# EAGLE design minicopter (EAGLE 7.2.0)
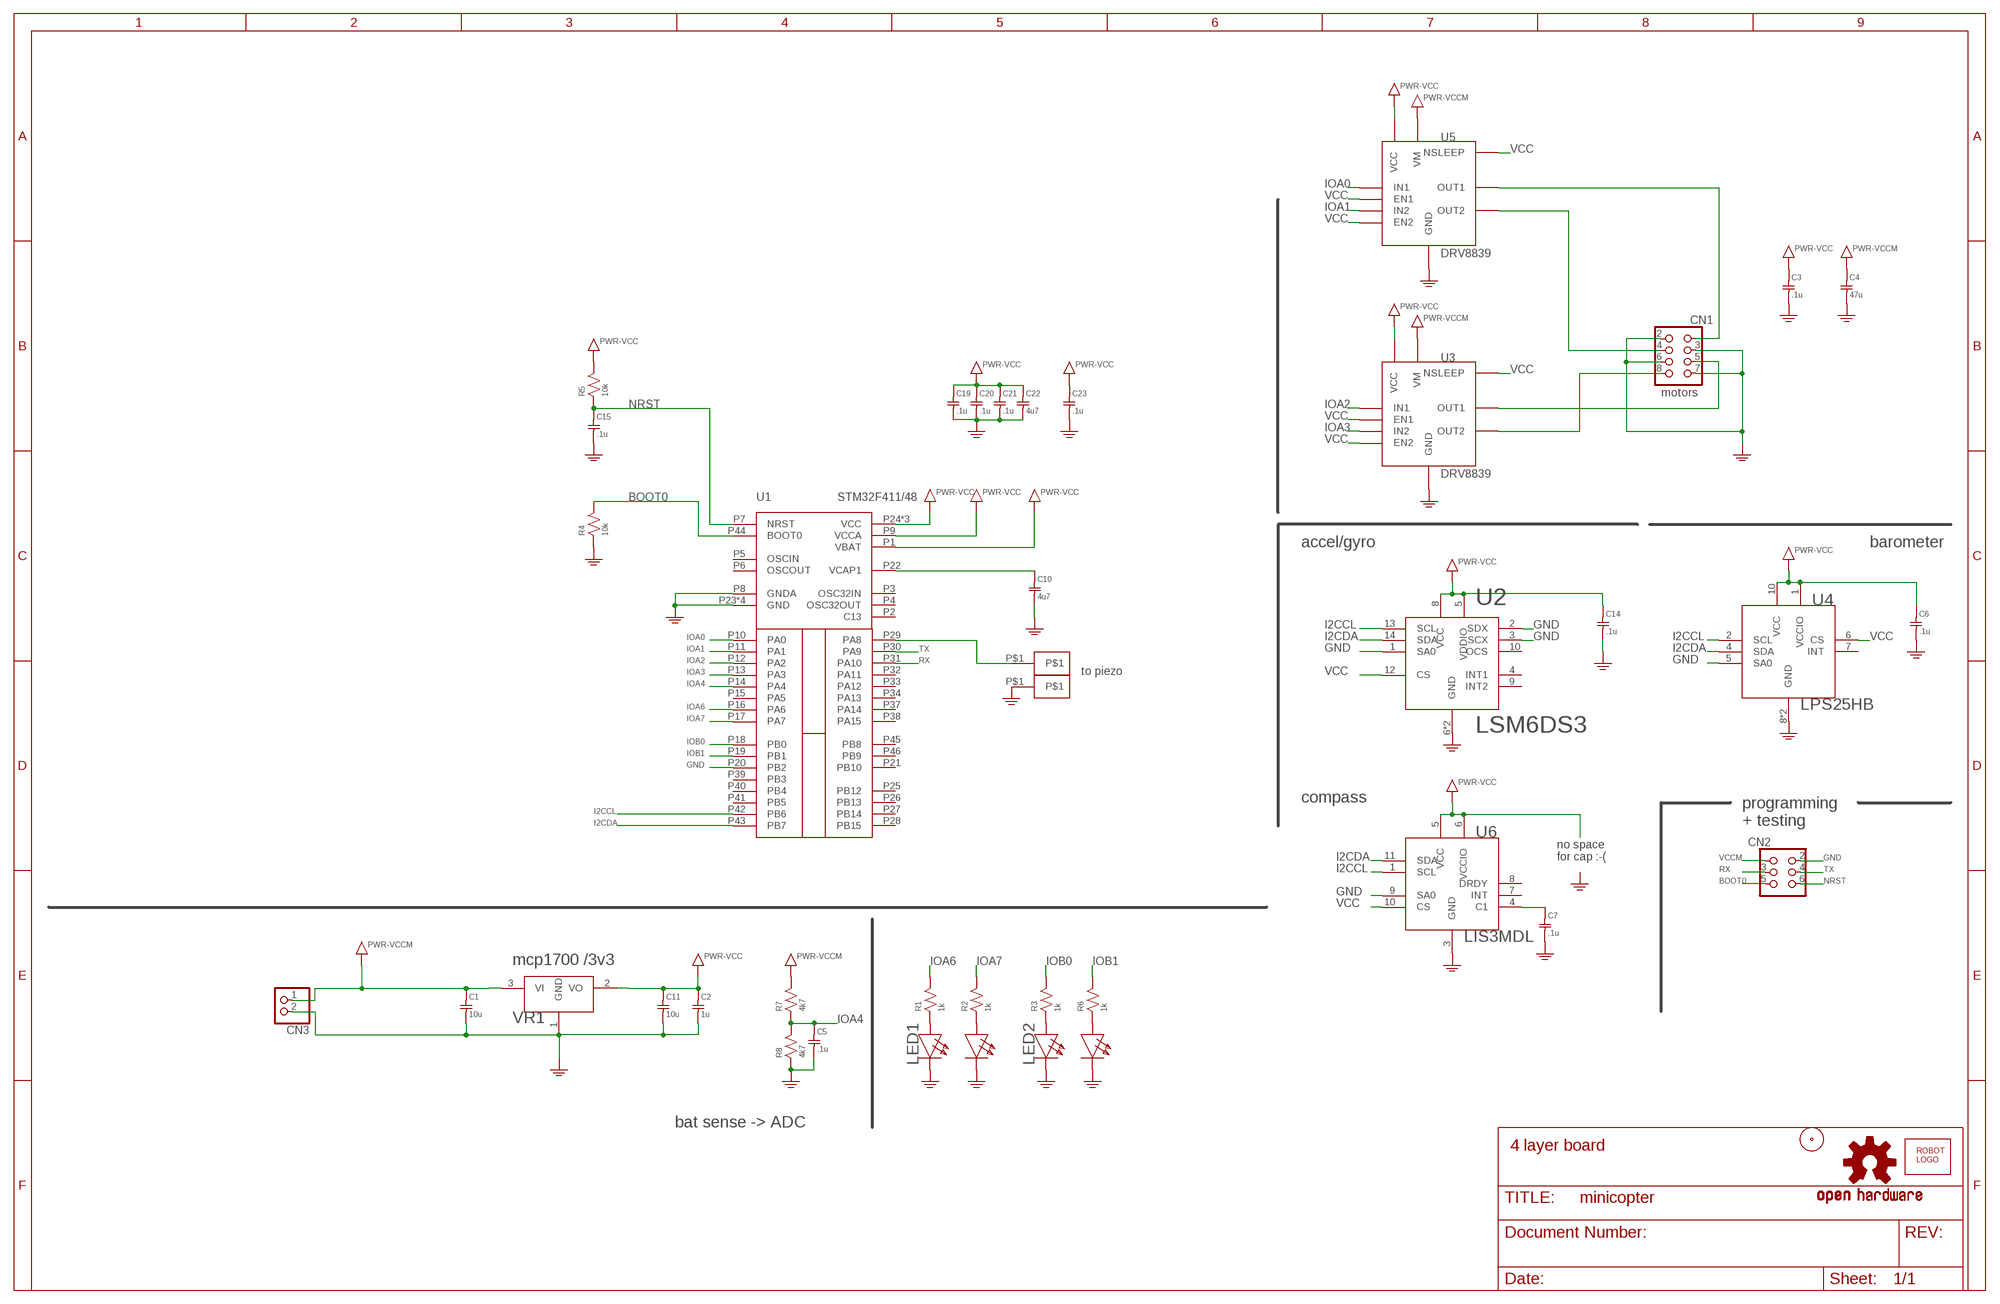
[diagram p0: schematic, sheet 1]

## Parts
C1  10u  C0603  [SMD0603]
C2  1u  C0603  [SMD0603]
C3  .1u  C0603  [SMD0603]
C4  47u  C0805  [SMD0805]
C5  .1u  C0603  [SMD0603]
C6  .1u  C0603  [SMD0603]
C7  .1u  C0603  [SMD0603]
C10  4u7  C0603  [SMD0603]
C11  10u  C0603  [SMD0603]
C14  .1u  C0603  [SMD0603]
C15  .1u  C0603  [SMD0603]
C19  .1u  C0603  [SMD0603]
C20  .1u  C0603  [SMD0603]
C21  .1u  C0603  [SMD0603]
C22  4u7  C0603  [SMD0603]
C23  .1u  C0603  [SMD0603]
CN1  HEADER-2X4  [HEADER-2X04-THM]
CN2  HEADER-3X2-PTH  [HEADER-3X2-PTH]
CN3  JST_2PIN-THM  [JST-PH-2-THM]
CN4  HEADER-1X1SMALL  [HEADER-1X1-SMALL]
CN5  HEADER-1X1SMALL  [HEADER-1X1-SMALL]
LED1  LED-DUAL0805  [SMD0805-DUAL]
LED2  LED-DUAL0805  [SMD0805-DUAL]
LOGO1  OSHW-LOGOM  [OSHW-LOGO-M]
R1  1k  R0603  [SMD0603]
R2  1k  R0603  [SMD0603]
R3  1k  R0603  [SMD0603]
R4  10k  R0603  [SMD0603]
R5  10k  R0603  [SMD0603]
R6  1k  R0603  [SMD0603]
R7  4k7  R0603  [SMD0603]
R8  4k7  R0603  [SMD0603]
U1  STM32F411/48  [UQPFN48]
U2  LSM6DS3  [LGA14A]
U3  DRV8839  [WSON12]
U4  LPS25HB  [HLGA10L]
U5  DRV8839  [WSON12]
U6  LIS3MDL  [LGA12]
U$1  ROBOTMAN-LOGO  [ROBOTMAN-LOGO]
U$2  FIDUCIAL  [FIDUCIAL]
VR1  mcp1700 /3v3  REGULATOR-SOT23-3  [SOT-23-3]

## Nets
BOOT0: CN2.5 R4.2 U1.P44(BOOT0)
GND: C1.2 C2.2 C3.2 C4.2 C5.2 C6.2 C7.2 C10.2 C11.2 C14.2 C15.2 C19.2 C20.2 C21.2 C22.2 C23.2 CN1.2 CN1.3 CN1.6 CN1.7 CN2.2 CN3.2 CN5.P$1 LED1.2(CB) LED1.3(CR) LED2.2(CB) LED2.3(CR) R4.1 R8.1 U1.P8(GNDA) U1.P20(PB2) U1.P23(GND) U1.P35(GND) U1.P47(GND) U1.PAD(GND) U2.1(SA0) U2.2(SDX) U2.3(SCX) U2.6(GND) U2.7(GND) U3.5(GND) U3.6(GND) U3.GND3(GND) U3.GND4(GND) U3.GND5(GND) U3.GND6(GND) U3.GND7(GND) U4.5(SA0) U4.8(GND) U4.9(GND) U5.5(GND) U5.6(GND) U5.GND3(GND) U5.GND4(GND) U5.GND5(GND) U5.GND6(GND) U5.GND7(GND) U6.3(GND) U6.9(SA0) VR1.1(GND) ; supply symbol labelled PWR-GND
I2CCL: U1.P42(PB6) U2.13(SCL) U4.2(SCL) U6.1(SCL)
I2CDA: U1.P43(PB7) U2.14(SDA) U4.4(SDA) U6.11(SDA)
IOA0: U1.P10(PA0) U5.10(IN1)
IOA1: U1.P11(PA1) U5.8(IN2)
IOA2: U1.P12(PA2) U3.10(IN1)
IOA3: U1.P13(PA3) U3.8(IN2)
IOA4: C5.1 R7.1 R8.2 U1.P14(PA4)
IOA6: R1.2 U1.P16(PA6)
IOA7: R2.2 U1.P17(PA7)
IOB0: R3.2 U1.P18(PB0)
IOB1: R6.2 U1.P19(PB1)
N$12: LED1.1(AB) R1.1
N$13: LED1.4(AR) R2.1
N$14: LED2.1(AB) R3.1
N$15: LED2.4(AR) R6.1
N$16: CN1.1 U5.3(OUT1)
N$17: CN1.4 U5.4(OUT2)
N$18: C10.1 U1.P22(VCAP1)
N$19: CN1.5 U3.3(OUT1)
N$20: CN1.8 U3.4(OUT2)
N$23: C7.1 U6.4(C1)
NRST: C15.1 CN2.6 R5.1 U1.P7(NRST)
PZ0: CN4.P$1 U1.P29(PA8)
RX: CN2.3 U1.P31(PA10)
TX: CN2.4 U1.P30(PA9)
VCC: C2.1 C3.1 C6.1 C11.1 C14.1 C19.1 C20.1 C21.1 C22.1 C23.1 R5.2 U1.P1(VBAT) U1.P9(VCCA) U1.P24(VCC) U1.P36(VCC) U1.P48(VCC) U2.5(VDDIO) U2.8(VCC) U2.12(CS) U3.7(EN2) U3.9(EN1) U3.11(NSLEEP) U3.12(VCC) U4.1(VCCIO) U4.6(CS) U4.10(VCC) U5.7(EN2) U5.9(EN1) U5.11(NSLEEP) U5.12(VCC) U6.5(VCC) U6.6(VCCIO) U6.10(CS) VR1.2(VO) ; supply symbol labelled PWR-VCC
VCCM: C1.1 C4.1 CN2.1 CN3.1 R7.2 U3.1(VM) U3.2(VM) U5.1(VM) U5.2(VM) VR1.3(VI) ; supply symbol labelled PWR-VCCM
Unconnected: U1.P2(C13) U1.P3(OSC32IN) U1.P4(OSC32OUT) U1.P5(OSCIN) U1.P6(OSCOUT) U1.P15(PA5) U1.P21(PB10) U1.P25(PB12) U1.P26(PB13) U1.P27(PB14) U1.P28(PB15) U1.P32(PA11) U1.P33(PA12) U1.P34(PA13) U1.P37(PA14) U1.P38(PA15) U1.P39(PB3) U1.P40(PB4) U1.P41(PB5) U1.P45(PB8) U1.P46(PB9) U2.4(INT1) U2.9(INT2) U2.10(OCS) U4.7(INT) U6.7(INT) U6.8(DRDY)

## Notes on the sheet
- motors
- accel/gyro | barometer
- to piezo
- compass
- programming
  + testing
- no space
  for cap :-(
- bat sense -> ADC
- 4 layer board

## Library data of the parts
C1-C7 C10 C11 C14 C15 C19-C23 = jaw:C
CN1 = jaw:HEADER-2X4: PIN HEADER
CN2 = jaw:HEADER-3X2
CN3 = adafruit:JST_2PIN: JST 2-Pin Connectors of various flavors SMT-RA (S2B-PH-SM4) 4UConnector #17311 SMT (B2B-PH-SM4) THM-RA (S2B-PH) THM (B2B-PH)
CN4 CN5 = jaw:HEADER-1X1
LED1 LED2 = jaw:LED-DUAL
LOGO1 = SparkFun-Aesthetics:OSHW-LOGO: Open Source Hardware Logo This logo indicates the piece of hardware it is found on incorporates a OSHW license and/or adheres to the definition of open source hardware found here: http://freedomdefined.org/OSHW
R1-R8 = jaw:R
U1 = jaw:STM32F411/48
U2 = jaw:LSM6DS3
U3 U5 = jaw:DRV8839
U4 = jaw:LPS25HB
U6 = jaw:LIS3MDL
U$1 = jaw:ROBOTMAN-LOGO
U$2 = jaw:FIDUCIAL
VR1 = jaw:REGULATOR

## Board
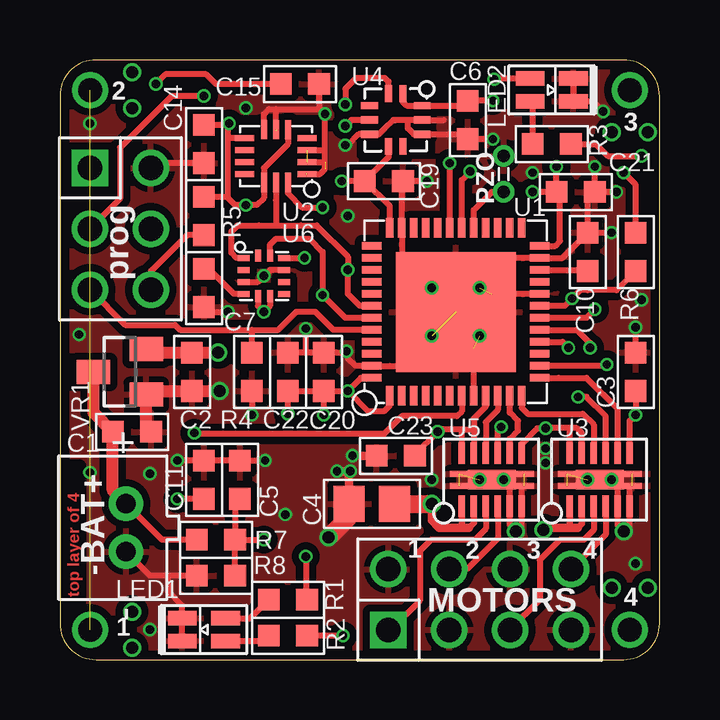
[diagram p1: board, top side]
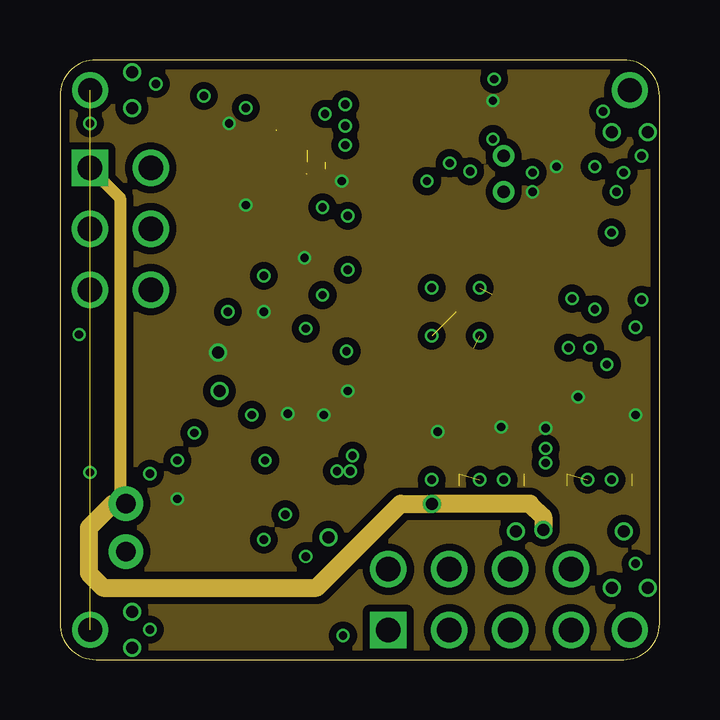
[diagram p2: board, inner layer Route2]
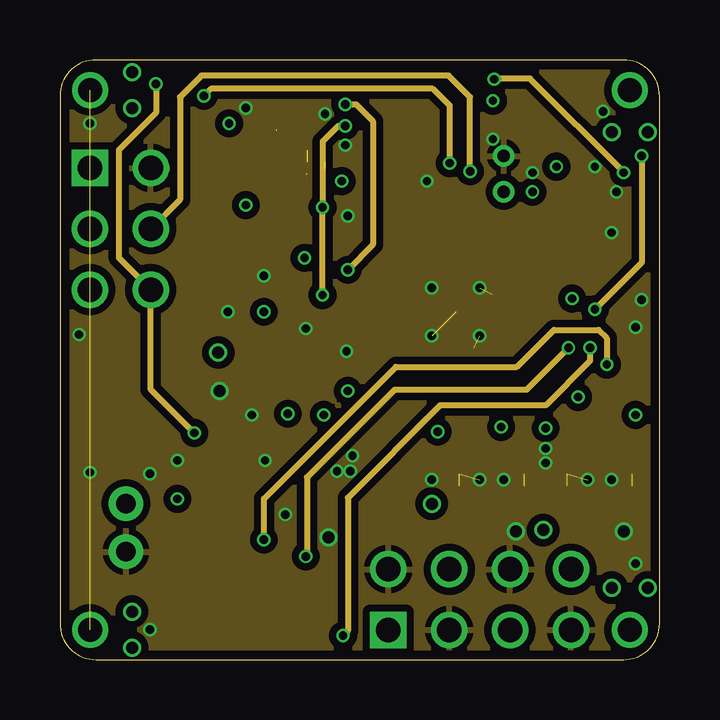
[diagram p3: board, inner layer Route15]
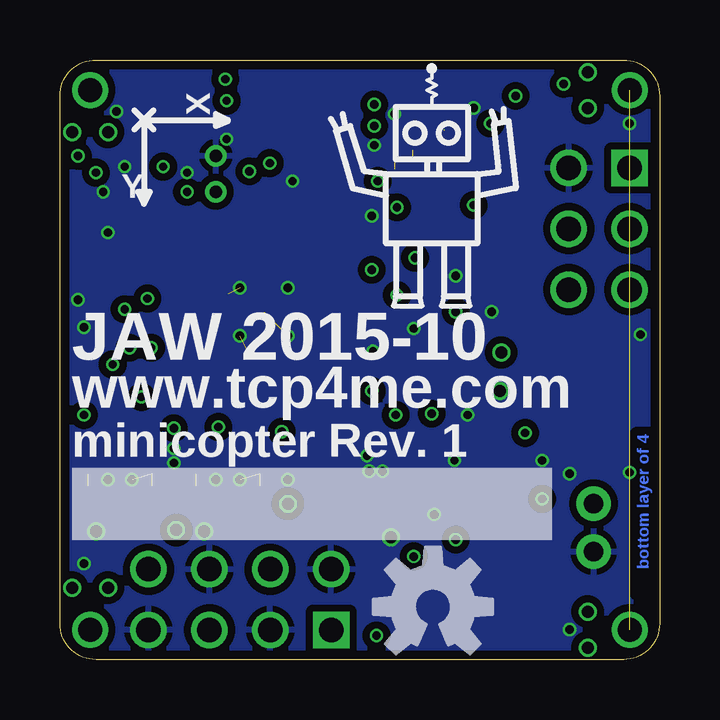
[diagram p4: board, bottom side, seen from below]

Size 25 x 25 mm. Coordinates in mm from the lower left corner, seen from the top.
Outline: 25,1.5 25,23.5 arc90 23.5,25 1.5,25 arc90 0,23.5 0,1.5 arc90 1.5,0 23.5,0 arc90 25,1.5
Copper layers (1*2*15*16): Top 0.035559375mm / dielectric 0.17018125mm / Route2 0.01778125mm / dielectric 47mil / Route15 0.01778125mm / dielectric 0.17018125mm / Bottom 0.035559375mm
Design rules "OSHPark-4layer *": minimum track width 5mil, minimum drill 10mil, track to track 5mil, track to pad 5mil, pad to pad 5mil, via to via 5mil, smd to smd 5mil, copper to edge 15mil, drill to drill 6mil, minimum pad ring 4mil, minimum via ring 4mil, stop-mask expansion 4mil, vias tented up to drill 0.5mm, thermal gap 10mil

### Footprints (pad centres in the part's own frame; a part is rotated, then mirrored left to right if it is on the bottom)
SMD0603 = smd 0.9 x 0.9: 1 -0.8,0; 2 0.8,0
SMD0805 = smd 1.3 x 1.5: 1 -0.95,0; 2 0.95,0
HEADER-2X04-THM = drill 1.016 square: 1 -3.81,-1.27 | drill 1.016: 2 -3.81,1.27; 3 -1.27,-1.27; 4 -1.27,1.27; 5 1.27,-1.27; 6 1.27,1.27; 7 3.81,-1.27; 8 3.81,1.27
HEADER-3X2-PTH = drill 1.016 square: 1 0,0 | drill 1.016: 2 0,2.54; 3 2.54,0; 4 2.54,2.54; 5 5.08,0; 6 5.08,2.54
JST-PH-2-THM = drill 0.8 pad 1.422: 1 1,0; 2 -1,0
HEADER-1X1-SMALL = drill 0.508 pad 0.889: P$1 0,0
SMD0805-DUAL = smd 1.2 x 0.6: 1 -0.9,-0.475; 2 0.9,-0.475; 3 0.9,0.475; 4 -0.9,0.475
UQPFN48 = smd 0.3 x 0.8: P1 -2.75,-3.5; P2 -2.25,-3.5; P3 -1.75,-3.5; P4 -1.25,-3.5; P5 -0.75,-3.5; P6 -0.25,-3.5; P7 0.25,-3.5; P8 0.75,-3.5; P9 1.25,-3.5; P10 1.75,-3.5; P11 2.25,-3.5; P12 2.75,-3.5; P25 2.75,3.5; P26 2.25,3.5; P27 1.75,3.5; P28 1.25,3.5; P29 0.75,3.5; P30 0.25,3.5; P31 -0.25,3.5; P32 -0.75,3.5; P33 -1.25,3.5; P34 -1.75,3.5; P35 -2.25,3.5; P36 -2.75,3.5 | smd 0.8 x 0.3: P13 3.5,-2.75; P14 3.5,-2.25; P15 3.5,-1.75; P16 3.5,-1.25; P17 3.5,-0.75; P18 3.5,-0.25; P19 3.5,0.25; P20 3.5,0.75; P21 3.5,1.25; P22 3.5,1.75; P23 3.5,2.25; P24 3.5,2.75; P37 -3.5,2.75; P38 -3.5,2.25; P39 -3.5,1.75; P40 -3.5,1.25; P41 -3.5,0.75; P42 -3.5,0.25; P43 -3.5,-0.25; P44 -3.5,-0.75; P45 -3.5,-1.25; P46 -3.5,-1.75; P47 -3.5,-2.25; P48 -3.5,-2.75 | smd 5 x 5: PAD 0,0
LGA14A = smd 0.8 x 0.25: 1 -1.3,0.75; 2 -1.3,0.25; 3 -1.3,-0.25; 4 -1.3,-0.75; 8 1.3,-0.75; 9 1.3,-0.25; 10 1.3,0.25; 11 1.3,0.75 | smd 0.25 x 0.8: 5 -0.5,-1.1; 6 0,-1.1; 7 0.5,-1.1; 12 0.5,1.1; 13 0,1.1; 14 -0.5,1.1
WSON12 = smd 0.28 x 0.9: 1 -1.25,-1.1; 2 -0.75,-1.1; 3 -0.25,-1.1; 4 0.25,-1.1; 5 0.75,-1.1; 6 1.25,-1.1; 7 1.25,1.1; 9 0.25,1.1; 10 -0.25,1.1; 11 -0.75,1.1; 12 -1.25,1.1 | smd 0.29 x 0.9: 8 0.75,1.1 | smd 0.8 x 0.25: GND3 -1.35,0.25; GND4 -1.35,-0.25; GND5 1.35,0.25; GND6 1.35,-0.25 | smd 2 x 0.8: GND7 0,0
HLGA10L = smd 0.7 x 0.3: 1 -1.1,0.3; 2 -1.1,-0.3; 6 1.1,-0.3; 7 1.1,0.3 | smd 0.3 x 0.7: 3 -0.6,-1.1; 4 0,-1.1; 5 0.6,-1.1; 8 0.6,1.1; 9 0,1.1; 10 -0.6,1.1
LGA12 = smd 0.5 x 0.25: 1 -0.85,0.75; 2 -0.85,0.25; 3 -0.85,-0.25; 4 -0.85,-0.75; 7 0.85,-0.75; 8 0.85,-0.25; 9 0.85,0.25; 10 0.85,0.75 | smd 0.25 x 0.5: 5 -0.25,-0.85; 6 0.25,-0.85; 11 0.25,0.85; 12 -0.25,0.85
SOT-23-3 = smd 1 x 1.4: 1 -0.95,-1.1; 2 0.95,-1.1; 3 0,1.1

### Placement (x,y rotation side)
C1  3,9.5 0 top
C2  5.5,12 270 top
C3  24,12 90 top
C4  13,6.5 180 top
C5  7.5,7.5 90 top
C6  17,22.5 270 top
C7  6,15.5 270 top
C10  22,17 90 top
C11  6,7.5 90 top
C14  6,21.5 270 top
C15  10,24 0 top
C19  13.5,19.95 0 top
C20  11,12 90 top
C21  21.5,19.5 0 top
C22  9.5,12 90 top
C23  14,8.5 180 top
CN1  17.5,2.5 0 top
CN2  1.25,20.5 270 top
CN3  2.75,5.5 90 top
CN4  18.5,19.5 0 top
CN5  18.5,21 0 top
LED1  6,1.25 180 top
LED2  20.5,23.75 0 top
LOGO1  9.45,2.2 0 bottom
R1  9.5,2.5 0 top
R2  9.5,1 0 top
R3  20.5,21.5 0 top
R4  8,12 90 top
R5  6,18.5 90 top
R6  24,17 270 top
R7  6.5,5 180 top
R8  6.5,3.5 0 top
U1  16.5,14.5 0 top
U2  9,21 180 top
U3  22.5,7.5 0 top
U4  14,22.5 270 top
U5  18,7.5 0 top
U6  8.5,16 0 top
U$1  9.5,19.05 0 bottom
U$2  10,8 0 top
VR1  2.5,12 90 top

### Tracks (layer width: path | path; a pad name or v marks a point on that pad's centre or on a via)
BOOT0
  Top 0.25: CN2.5 2.72,13.95 4.8,13.95 5,13.75 8,13.75 | U1.P44 11.4,13.75 10.65,14.5 9.85,14.5 9.1,13.75 8,13.75 | R4.2 8,13.75
GND  (via drill 0.35, 0.5)  (13 unrouted)
  Top 0.25: 15,12.35 14.9,12.25 U1.P47 12.35,12.25 12,12.55 12,12.8 | U1.P8 17.25,13 | U1.P20 18,15.25 17.95,15.2 | 18.45,16.75 U1.P23 20.95,16.75 C10.2 | 14.3,16.4 14.25,16.45 U1.P35 14.25,19.55 C19.2 v15.3,19.95 | C20.2 10.25,12.8 | 10.25,12.8 C22.2 | C20.2 10.5,12.8 10.25,12.8 | 10.25,12.8 v10.25,13.8 | C20.2 11.1,12.8 11.55,12.8 12,12.8 | C10.2 22,19.2 C21.2 | C10.2 v23,17.8 | C21.2 v22.3,20.55 | v23.2,19.5 C21.2 | v4.9,8.3 C11.2 C5.2 v8.55,8.3 | LED1.3 LED1.2 5.1,2.25 4.5,2.85 4.5,3.5 | LED2.3 LED2.2 22.23,23.27 v22.65,22.85 | R8.1 4.5,3.5 | 4.5,3.5 3.75,3.5 CN3.2 | 12,12.8 v11.95,12.85 | U2.7 8.5,22.75 8.7,22.95 9,22.95 | 9,22.95 10.85,22.95 v11.05,22.75 | 9,22.05 9,22.95 | U2.3 11.05,21.25 | U2.2 11.05,20.75 | 10.25,20.25 10.85,20.25 11.05,20.45 v11.05,22.75 | C14.2 3.99,20.7 CN2.2 | U4.9 15,22.5 | 15,22.5 14.5,22.5 | 14.5,22.5 13.9,22.5 | v18.05,21.7 C6.2 16.8,21.9 U4.8 14.75,21.9 14.5,22.15 14.5,22.5 | v11.9,21.45 12,21.45 12.45,21.9 U4.5 13.3,21.9 13.55,22.15 13.9,22.5 | 15,22.5 16,22.5 | 23.2,7.45 23.25,7.4 U3.5 23.25,5.6 v23.5,5.35 23.75,5.6 U3.6 23.75,7.15 U3.GND6 | 18.75,7.5 U5.5 18.75,5.6 v19,5.35 19.25,5.6 U5.6 19.25,7.15 U5.GND6 | C3.2 v24,13.85 | R4.1 v8,10.2 | v11.05,22.75 10.8,23 C15.2 | C7.2 6.2,14.5 v7,14.5 | U6.3 8.25,15.75 v8.5,16 8.75,16.25 U6.9 | 13.9,22.5 14,22.5
  Top 0.35: C4.2 12.05,7.8 v12.1,7.85 v11.55,7.85 | v12.2,8.5 C23.2
  Top 0.5: C1.2 3.6,9.7 VR1.1 3.65,11.05 3.8,11.2 C2.2 v6.65,11.2
  Top 0.75: C4.2 12.05,5.95 v11.2,5.1
  other vias: 15.5,15.5 17.5,15.5 17.5,13.5 15.5,13.5 3.75,1.25 1.25,7.8 3.75,7.75 9.4,6.05 1.25,22.35 7.75,23 12,18.5 0.8,13.55 19.7,20.3 20.25,8.8 20.25,8.2 15.5,7.5 24,4 24.25,15 17.5,7.5 18.5,7.5 22,7.5 23,7.5
  pour Bottom (isolate 0.3): 0,0 0,25.5 25.5,25.5 25.5,0
  pour Route15 (isolate 0.3): -0.05,0 -0.05,25.5 25.45,25.5 25.45,0
  pour Top (isolate 0.3, rank 2): -0.05,0 -0.05,25.5 25.45,25.5 25.45,0
I2CCL  (via drill 0.35)
  Top 0.25: U1.P42 12.5,14.75 12,15.25 v12,16.25 12,16.8 10.7,18.1 10.05,18.1 8.95,18.1 | U2.13 9,19.15 9,18.15 8.95,18.1 | U4.2 13.7,24.1 13.55,24.25 12.35,24.25 11.9,23.8 v11.9,23.15 | U6.1 7.35,16.75 7.15,16.95 7.15,17.85 7.4,18.1 8.3,18.1 8.95,18.1
  Route15 0.25: v11.9,23.15 12.35,23.15 13.05,22.45 13.05,17.3 v12,16.25
I2CDA  (via drill 0.35)
  Top 0.25: U1.P43 11.9,14.25 v10.95,15.2 10.95,17 10.4,17.55 9,17.55 8.75,17.3 U6.11 | U2.14 9.5,19.45 10.1,18.85 v10.95,18.85 | U4.4 12.15,22.5 v11.9,22.25
  Route15 0.25: v10.95,15.2 v10.95,18.85 10.95,21.6 11.6,22.25 v11.9,22.25
IOA0
  Top 0.25: U1.P10 18.25,10.4 17.75,9.9 U5.10
IOA1
  Top 0.25: U5.8 18.75,9.2 19.1,9.55 19.1,9.95 18.75,10.3 U1.P11
IOA2
  Top 0.25: U1.P12 19.25,10.5 19.5,10.25 21.8,10.25 22.25,9.8 U3.10
IOA3
  Top 0.25: U1.P13 20.8,11.75 21.95,11.75 23.25,10.45 U3.8
IOA4  (via drill 0.35)
  Top 0.25: R8.2 R7.1 | R7.1 v8.5,5 | v22.8,12.3 22.75,12.25 U1.P14 | C5.1 7.3,6.5 R7.1
  Route15 0.25: v8.5,5 8.5,6.7 14,12.2 19.05,12.2 20.6,13.75 22.45,13.75 22.8,13.4 22.8,12.4 v22.8,12.3
IOA6  (via drill 0.35)
  Top 0.25: U1.P16 20.95,13.25 v21.2,13 | v10.25,4.3 10.25,2.55 R1.2
  Route15 0.25: v21.2,13 19.45,11.25 13.95,11.25 10.3,7.6 10.3,4.35 v10.25,4.3
IOA7  (via drill 0.35)
  Top 0.25: U1.P17 21.55,13.75 22.1,13.2 v22.1,13 | v11.8,1 R2.2
  Route15 0.25: v22.1,13 22.1,12.45 20.25,10.6 15.85,10.6 12,6.75 12,1.2 v11.8,1
IOB0  (via drill 0.35)
  Top 0.25: v22.3,14.6 21.95,14.25 U1.P18 | R3.2 22.35,21.5 22.85,21 v24.25,21
  Route15 0.25: v24.25,21 24.25,16.55 v22.3,14.6
IOB1  (via drill 0.35)
  Top 0.25: U1.P19 21.05,14.75 v21.35,15.05 21.7,15.4 22,15.4 23.2,15.4 R6.2
  Route15 0.25: 21.3,15 v21.35,15.05
N$1  (via drill 1)  (1 unrouted)
  other vias: 1.25,23.75 1.25,1.25
N$2  (via drill 1)
  other vias: 23.75,1.25
N$3  (via drill 1)
  other vias: 23.75,23.75
N$4  (via drill 0.5)
  other vias: 23,22
N$5  (via drill 0.5)
  other vias: 24.5,22
N$6  (via drill 0.5)
  other vias: 3,24.5
N$7  (via drill 0.5)
  other vias: 3,23
N$8  (via drill 0.5)
  other vias: 23,3
N$9  (via drill 0.5)
  other vias: 24.5,3
N$10  (via drill 0.5)
  other vias: 3,2
N$11  (via drill 0.5)
  other vias: 3,0.5
N$12
  Top 0.25: LED1.1 7.92,1.73 R1.1
N$13
  Top 0.25: LED1.4 8.47,0.78 R2.1
N$14
  Top 0.25: LED2.1 19.7,23.27 R3.1
N$15  (via drill 0.35)
  Top 0.25: LED2.4 18.12,24.23 v18.1,24.2 | R6.1 24,19.8 v23.5,20.3
  Route15 0.25: v23.5,20.3 23.5,20.32 LED2.4 18.12,24.23 v18.1,24.2
N$16
  Top 0.25: U5.3 17.75,5.45 17.3,5 15.47,5 15,4.53 15,2.45 13.78,1.23 CN1.1
N$17
  Top 0.25: U5.4 18.25,5.05 17,3.8 16.26,3.8 CN1.4
N$18
  Top 0.25: U1.P22 21.95,16.25 C10.1
N$19
  Top 0.25: U3.3 22.25,5.4 21.85,5 20.85,5 20,4.15 20,2.5 18.77,1.27 CN1.5
N$20
  Top 0.25: U3.4 22.75,5.21 CN1.8
N$21
  cutout Top: 7.5,22.6 11.05,22.6 11.05,19.75 7.5,19.75
N$22
  cutout Top: 12.5,24 15.5,24 15.5,21 12.5,21
N$23
  Top 0.25: U6.4 7.25,15.25 6.5,16 6.2,16.3 C7.1
N$24
  cutout Top: 18.5,6.9 19.5,6.9 19.5,6 18.5,6
N$25
  cutout Top: 23,6.9 24,6.9 24,6.05 23,6.05
NRST  (via drill 0.35)
  Top 0.25: U1.P7 16.75,10.35 16.55,10.15 14.25,10.15 13.5,9.4 5.65,9.4 v5.6,9.45 | R5.1 5.3,17.7 3.8,16.2 CN2.6 | C15.1 6.5,24 6.1,24.4 4.4,24.4 v4,24
  Route15 0.25: v5.6,9.45 3.79,11.26 CN2.6 2.45,16.76 2.45,21.25 4,22.8 v4,24
PZ0
  Top 0.25: U1.P29 17.25,18.75 18,19.5 CN4.P$1
RX  (via drill 0.35)
  Top 0.25: U1.P31 v16.25,20.7 | v6,23.5 4.65,23.5 2.5,21.35 2.5,19.21 CN2.3
  Route15 0.25: v16.25,20.7 16.25,23.1 15.55,23.8 6.3,23.8 v6,23.5
TX  (via drill 0.35)
  Top 0.25: U1.P30 16.75,20 v17.1,20.35
  Route15 0.25: CN2.4 4.43,18.6 5,19.17 5,23.45 5.9,24.35 16.2,24.35 17.1,23.45 v17.1,20.35
VCC  (via drill 0.35, 0.5)
  Top 0.25: C20.1 C22.1 v9.5,10.25 | C20.1 v12,11.2 | U1.P48 12.55,11.75 v12,11.2 | U1.P9 17.75,10.55 17.25,10.05 17.25,9.6 | U1.P1 13.75,10.6 13.5,10.35 12.85,10.35 v12,11.2 | U1.P24 20.65,17.25 20.85,17.45 20.85,19.4 C21.1 | C21.1 v20.7,20.55 | C21.1 v19.7,19.5 | U1.P36 13.75,18.9 C19.1 | C19.1 v11.75,19.95 | C11.1 v4.9,6.7 | v11,10.2 C20.1 | U2.5 9.5,21.5 8.5,20.5 U2.12 8.5,19.25 8.2,18.95 7.3,18.95 7,19.25 7,19.35 | C14.1 7.05,22.3 v7.05,22.35 7,22.35 7,21.7 | 7,19.35 7,21.7 | U4.1 14.3,23.25 14.45,23.1 U4.10 16.8,23.1 C6.1 v18.05,23.3 | U4.6 13.7,20.95 C19.1 | 17.25,9.6 U5.11 | U5.12 16.75,9.6 | 16.75,9.6 17.25,9.6 | U5.9 18.25,9.55 v18.4,9.7 | C23.1 14.8,8.55 v15.75,9.5 15.85,9.6 16.75,9.6 | U5.7 19.25,9 19.9,9.65 20.05,9.65 v20.25,9.65 21.25,9.65 | U3.11 21.75,9.45 21.55,9.65 21.25,9.65 | U3.12 21.25,9.65 | U3.7 23.75,9.95 v24,10.2 C3.1 | U3.9 22.75,10.15 21.95,10.95 v21.6,10.95 | R5.2 6.95,19.3 7,19.35 | U6.5 8.25,14.75 v8.5,14.5 8.75,14.75 U6.6 | U6.10 v10.2,16.75 | U2.8 7.05,21.75 7,21.7
  Top 0.5: VR1.2 3.75,12.8 C2.1 v6.6,12.8
  other vias: 7.75,18.95
  pour Route2 (isolate 0.3): -0.05,0 -0.05,25.5 25.45,25.5 25.45,0
VCCM  (via drill 0.5)
  Top 0.25: R7.2 4.25,5 CN3.1 | 21.25,5.6 21.15,5.5 | 16.75,5.55 16.7,5.5
  Top 0.28: U3.2 21.75,5.65 21.6,5.5 | U3.1 21.25,5.6 | U5.2 17.25,5.7 17.05,5.5 | U5.1 16.75,5.55
  Top 0.35: 21.6,5.5 21.15,5.5 20.25,5.5 v20.15,5.4 | 17.05,5.5 16.7,5.5 15.8,5.5 15.5,5.8 v15.5,6.5
  Top 0.5: CN3.1 2.2,7.05 C1.1 1.4,10.3 VR1.3
  Top 0.75: C4.1 v15.5,6.5
  Route2 0.5: CN2.1 2.5,19.25 2.5,6.75 CN3.1
  Route2 0.75: CN3.1 2.2,6.5 1.2,5.5 1.2,3.6 1.8,3 10.7,3 14.2,6.5 v15.5,6.5 19.6,6.5 20.15,5.95 v20.15,5.4

### Text on the board
Top: top layer of 4
Bottom: bottom layer of 4
tPlace: 2 | 3 | PZO | prog | -BAT+ | 1 | 2 | 3 | 4 | MOTORS | 4 | 1
bPlace: X | Y | JAW 2015-10 | www.tcp4me.com | minicopter Rev. 1